# EAGLE design h-bridge (EAGLE 6.4)
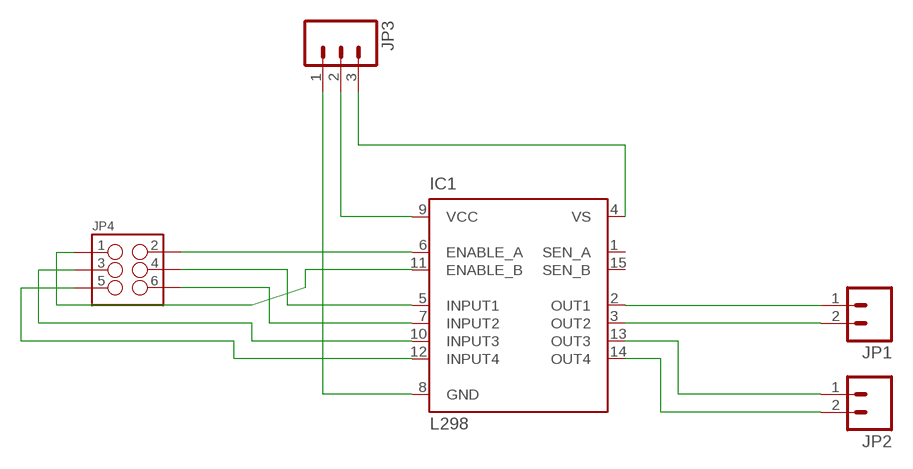
[diagram p0: schematic, sheet 1]

## Parts
IC1  L298  [MULTIWATT-15]
JP1  M023.5MM  [SCREWTERMINAL-3.5MM-2]
JP2  M023.5MM  [SCREWTERMINAL-3.5MM-2]
JP3  M03SCREW  [SCREWTERMINAL-3.5MM-3]
JP4  M03X22X3_SILK_SM  [2X3]

## Nets
A_1: IC1.5(INPUT1) JP4.4
A_2: IC1.7(INPUT2) JP4.6
A_EN: IC1.6(ENABLE_A) JP4.2
A_OUT1: IC1.2(OUT1) JP1.1
A_OUT2: IC1.3(OUT2) JP1.2
B_1: IC1.10(INPUT3) JP4.3
B_2: IC1.12(INPUT4) JP4.5
B_EN: IC1.11(ENABLE_B) JP4.1
B_OUT1: IC1.13(OUT3) JP2.1
B_OUT2: IC1.14(OUT4) JP2.2
GND: IC1.8(GND) JP3.1
VCC: IC1.9(VCC) JP3.2
VS: IC1.4(VS) JP3.3
Unconnected: IC1.1(SEN_A) IC1.15(SEN_B)

## Library data of the parts
IC1 = iStivi - ICs:L298: DUAL FULL-BRIDGE DRIVER; MPN: L298N; OC_FARNELL: 1589425; OC_NEWARK: 32M1527
JP1 JP2 = iStivi - Header-Connector:M02: Header 2 Standard 2-pin 0.1" header. Use with straight break away headers (SKU : PRT-00116), right angle break away headers (PRT-00553), swiss pins (PRT-00743), machine pins (PRT-00117), and female headers (PRT-00115). Molex polarized connector foot print use with SKU : PRT-08233 with associated crimp pins and housings.
JP3 = iStivi - Header-Connector:M03: Header 3 Standard 3-pin 0.1" header. Use with straight break away headers (SKU : PRT-00116), right angle break away headers (PRT-00553), swiss pins (PRT-00743), machine pins (PRT-00117), and female headers (PRT-00115). Molex polarized connector foot print use with SKU : PRT-08232 with associated crimp pins and housings.
JP4 = iStivi - Header-Connector:M03X2: 2x3 .1" header. Shrouded, with keying- CONN-10681 SMT- CONN-11415 Pogo pins- HW-11044

## Board
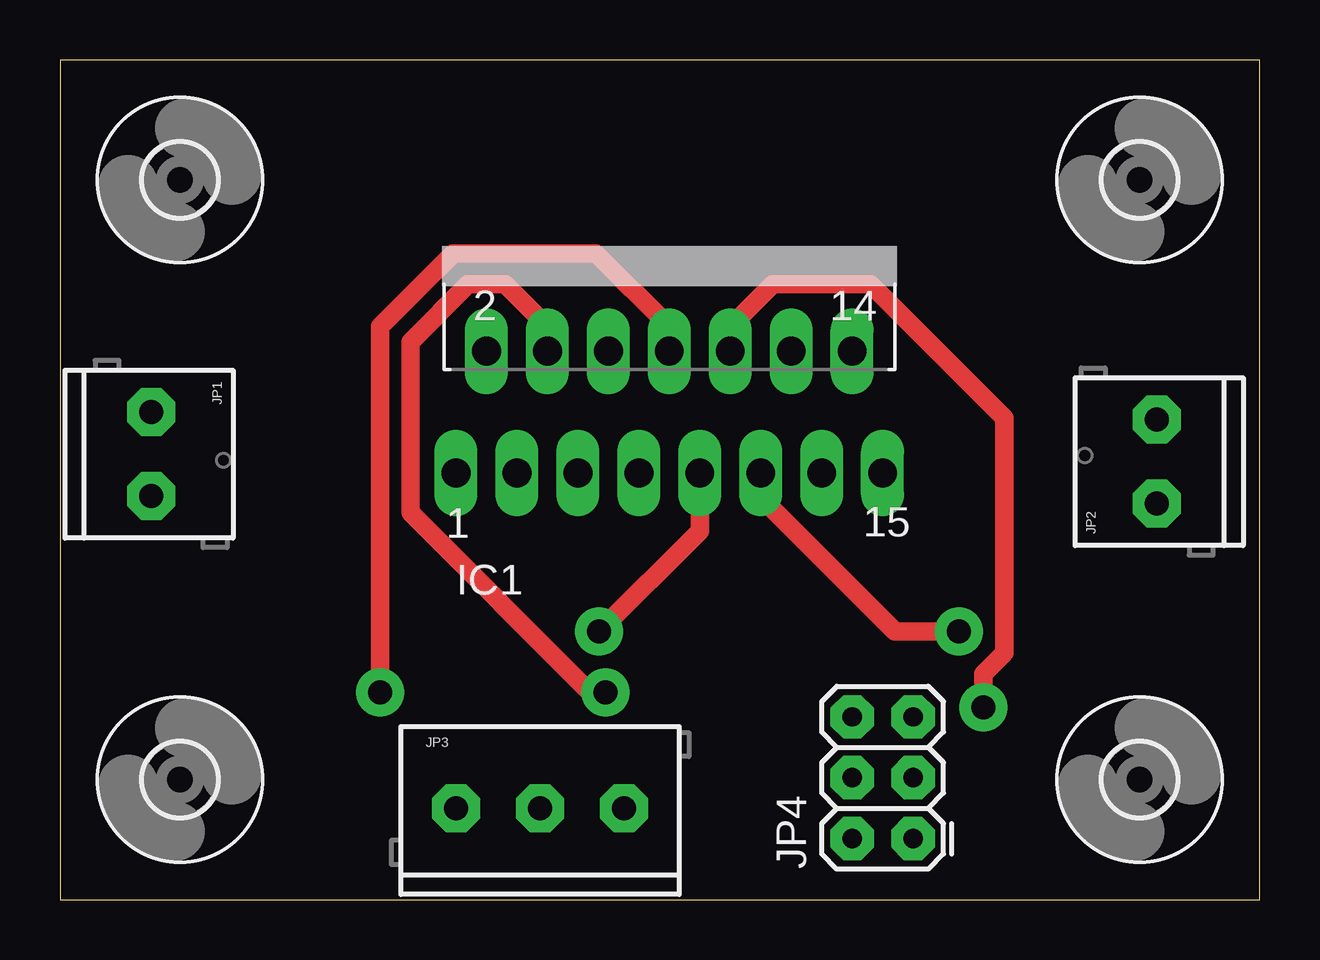
[diagram p1: board, top side]
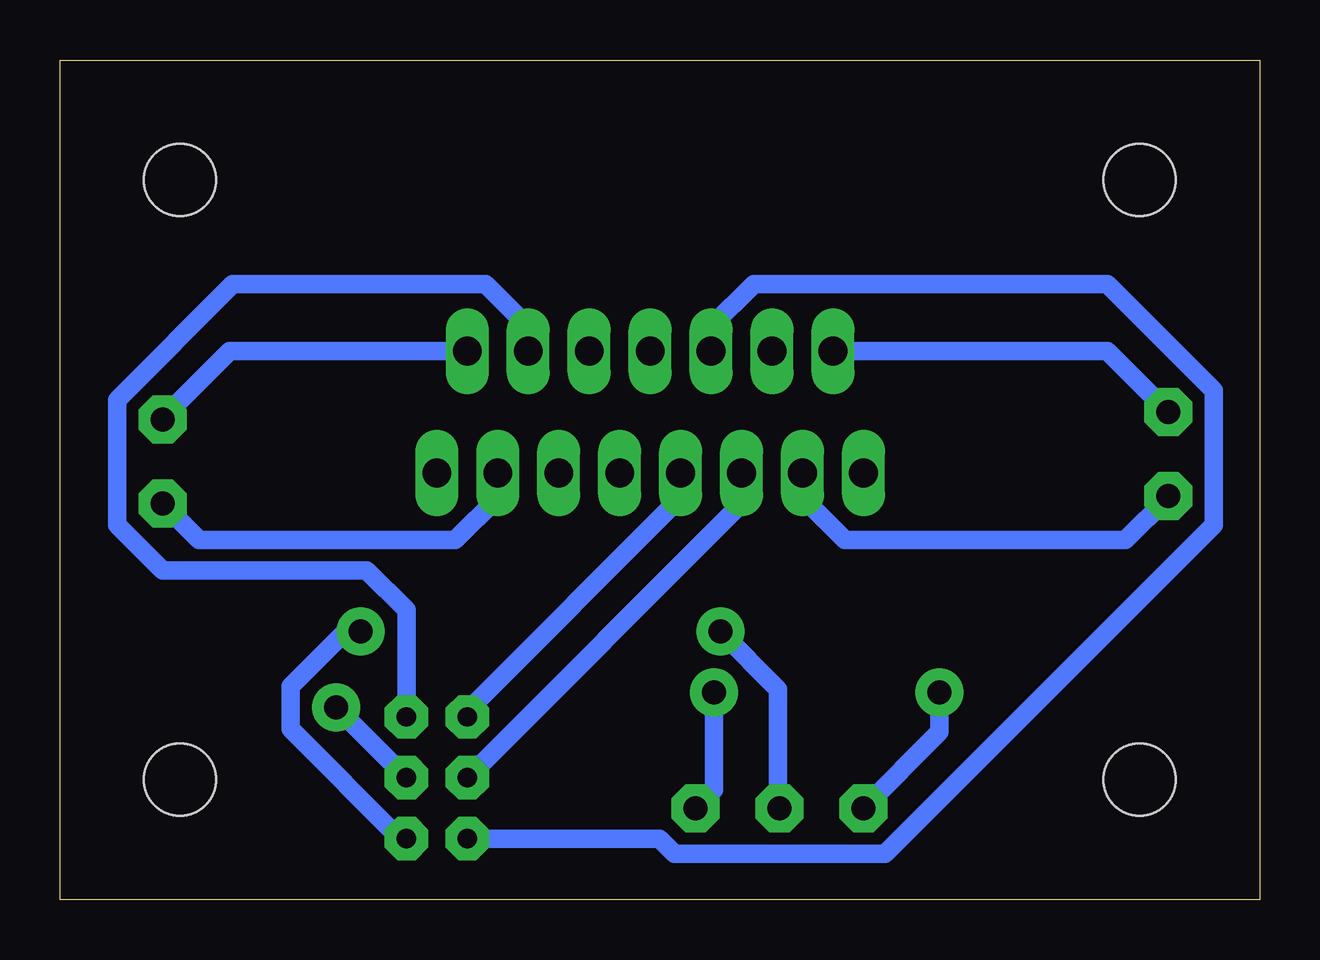
[diagram p2: board, bottom side, seen from below]

Size 50 x 35 mm. Coordinates in mm from the lower left corner, seen from the top.
Outline: 0,0 50,0 50,35 0,35 0,0
Copper layers (1*16): Top 0.035mm / dielectric 1.5mm / Bottom 0.035mm
Design rules "default *": minimum track width 30mil, minimum drill 1mm, track to track 20mil, track to pad 20mil, pad to pad 8mil, via to via 20mil, smd to smd 8mil, copper to edge 40mil, drill to drill 8mil, minimum pad ring 10mil, minimum via ring 0.5mm, stop-mask expansion 4mil, vias tented up to drill 0mil, thermal gap 10mil
tRestrict: area 0,14 to 7.6,22.9; area 41.9,14 to 50.2,22.9; area 12.7,0 to 27.9,7.6; area 31.1,0.6 to 37.5,9.5

### Footprints (pad centres in the part's own frame; a part is rotated, then mirrored left to right if it is on the bottom)
MULTIWATT-15 = drill 1.2 long: 1 -8.89,-7.62; 2 -7.62,-2.54; 3 -6.35,-7.62; 4 -5.08,-2.54; 5 -3.81,-7.62; 6 -2.54,-2.54; 7 -1.27,-7.62; 8 0,-2.54; 9 1.27,-7.62; 10 2.54,-2.54; 11 3.81,-7.62; 12 5.08,-2.54; 13 6.35,-7.62; 14 7.62,-2.54; 15 8.89,-7.62
SCREWTERMINAL-3.5MM-2 = drill 1 pad 2 octagon: 1 0,0; 2 3.5,0
SCREWTERMINAL-3.5MM-3 = drill 1 pad 2 octagon: 1 0,0; 2 3.5,0; 3 7,0
2X3 = drill 0.8 pad 1.8 octagon: 1 0,0; 2 0,2.54; 3 2.54,0; 4 2.54,2.54; 5 5.08,0; 6 5.08,2.54
3,0 = hole 3: 0,0

### Placement (x,y rotation side)
IC1  25.4,25.4 0 top
JP1  3.81,20.32 270 top
JP2  45.72,16.51 90 top
JP3  16.51,3.81 0 top
JP4  35.56,2.54 90 top
U$1  [3,0]  45,30 0 top
U$2  [3,0]  5,5 0 top
U$3  [3,0]  5,30 0 top
U$4  [3,0]  45,5 0 top

### Tracks (layer width: path | path; a pad name or v marks a point on that pad's centre or on a via)
A_1
  Bottom 0.762: IC1.5 21.59,16.51 JP4.4
A_2
  Bottom 0.762: JP4.6 33.02,7.87 24.13,16.76 IC1.7
A_EN
  Bottom 0.762: JP4.2 25.02,2.54 24.38,1.91 15.62,1.91 1.91,15.62 1.91,21.21 6.35,25.65 21.08,25.65 22.86,23.88 IC1.6
A_OUT1
  Bottom 0.762: IC1.2 6.35,22.86 JP1.1
A_OUT2
  Bottom 0.762: IC1.3 19.05,16.76 17.27,14.99 5.59,14.99 3.81,16.76 JP1.2
B_1  (via drill 1)
  Top 0.762: v38.48,8 38.48,9.4 39.37,10.29 39.37,20.07 33.78,25.65 29.72,25.65 27.94,23.88 IC1.10
  Bottom 0.762: v38.48,8 JP4.3
B_2
  Bottom 0.762: JP4.5 35.56,12.06 37.21,13.72 45.72,13.72 47.62,15.62 47.62,20.83 42.8,25.65 32.26,25.65 30.48,23.88 IC1.12
B_EN  (via drill 1)
  Top 0.762: IC1.11 29.21,16.76 34.8,11.18 v37.47,11.18
  Bottom 0.762: v37.47,11.18 38.1,11.18 40.39,8.89 40.39,7.11 35.81,2.54 JP4.1
B_OUT1
  Bottom 0.762: IC1.13 31.75,16.76 33.53,14.99 44.2,14.99 JP2.1
B_OUT2
  Bottom 0.762: IC1.14 42.93,22.86 45.72,20.07 JP2.2
GND  (via drill 1)
  Top 0.762: IC1.8 25.4,23.88 22.35,26.92 16.38,26.92 13.34,23.88 v13.34,8.64
  Bottom 0.762: v13.34,8.64 13.34,6.99 JP3.1
VCC  (via drill 1)
  Top 0.762: IC1.9 26.67,15.37 v22.48,11.18
  Bottom 0.762: v22.48,11.18 20.07,8.76 20.07,3.81 JP3.2
VS  (via drill 1)
  Top 0.762: IC1.4 20.32,23.88 18.54,25.65 17.02,25.65 14.61,23.24 14.61,16.13 22.1,8.64 v22.73,8.64
  Bottom 0.762: v22.73,8.64 22.73,4.57 23.5,3.81 JP3.3